# Altium schematic sheet SAMC21_one.SchDoc: Sheet Description
size A3; Organization: Organization; Address1: Address1; Address2: Address2; Address3: Address3; Address4: Address4; DocumentNumber: 1; Revision: 0; SheetNumber: 2; SheetTotal: 2; PageSetup: Record=PageOptions|CenterHorizontal=True|CenterVertical=True|PrintScale=1.00|XCorrection=1.00|YCorrection=1.00|PrintKind=1|BorderSize=5000000|LeftOffset=0|BottomOffset=0|Orientation=2|PaperLength=1000|PaperWidth=1000|Scale=100|PaperSource=7|PrintQuality=-4|MediaType=1|DitherType=10|PaperKind=A3|PrintScaleMode=0
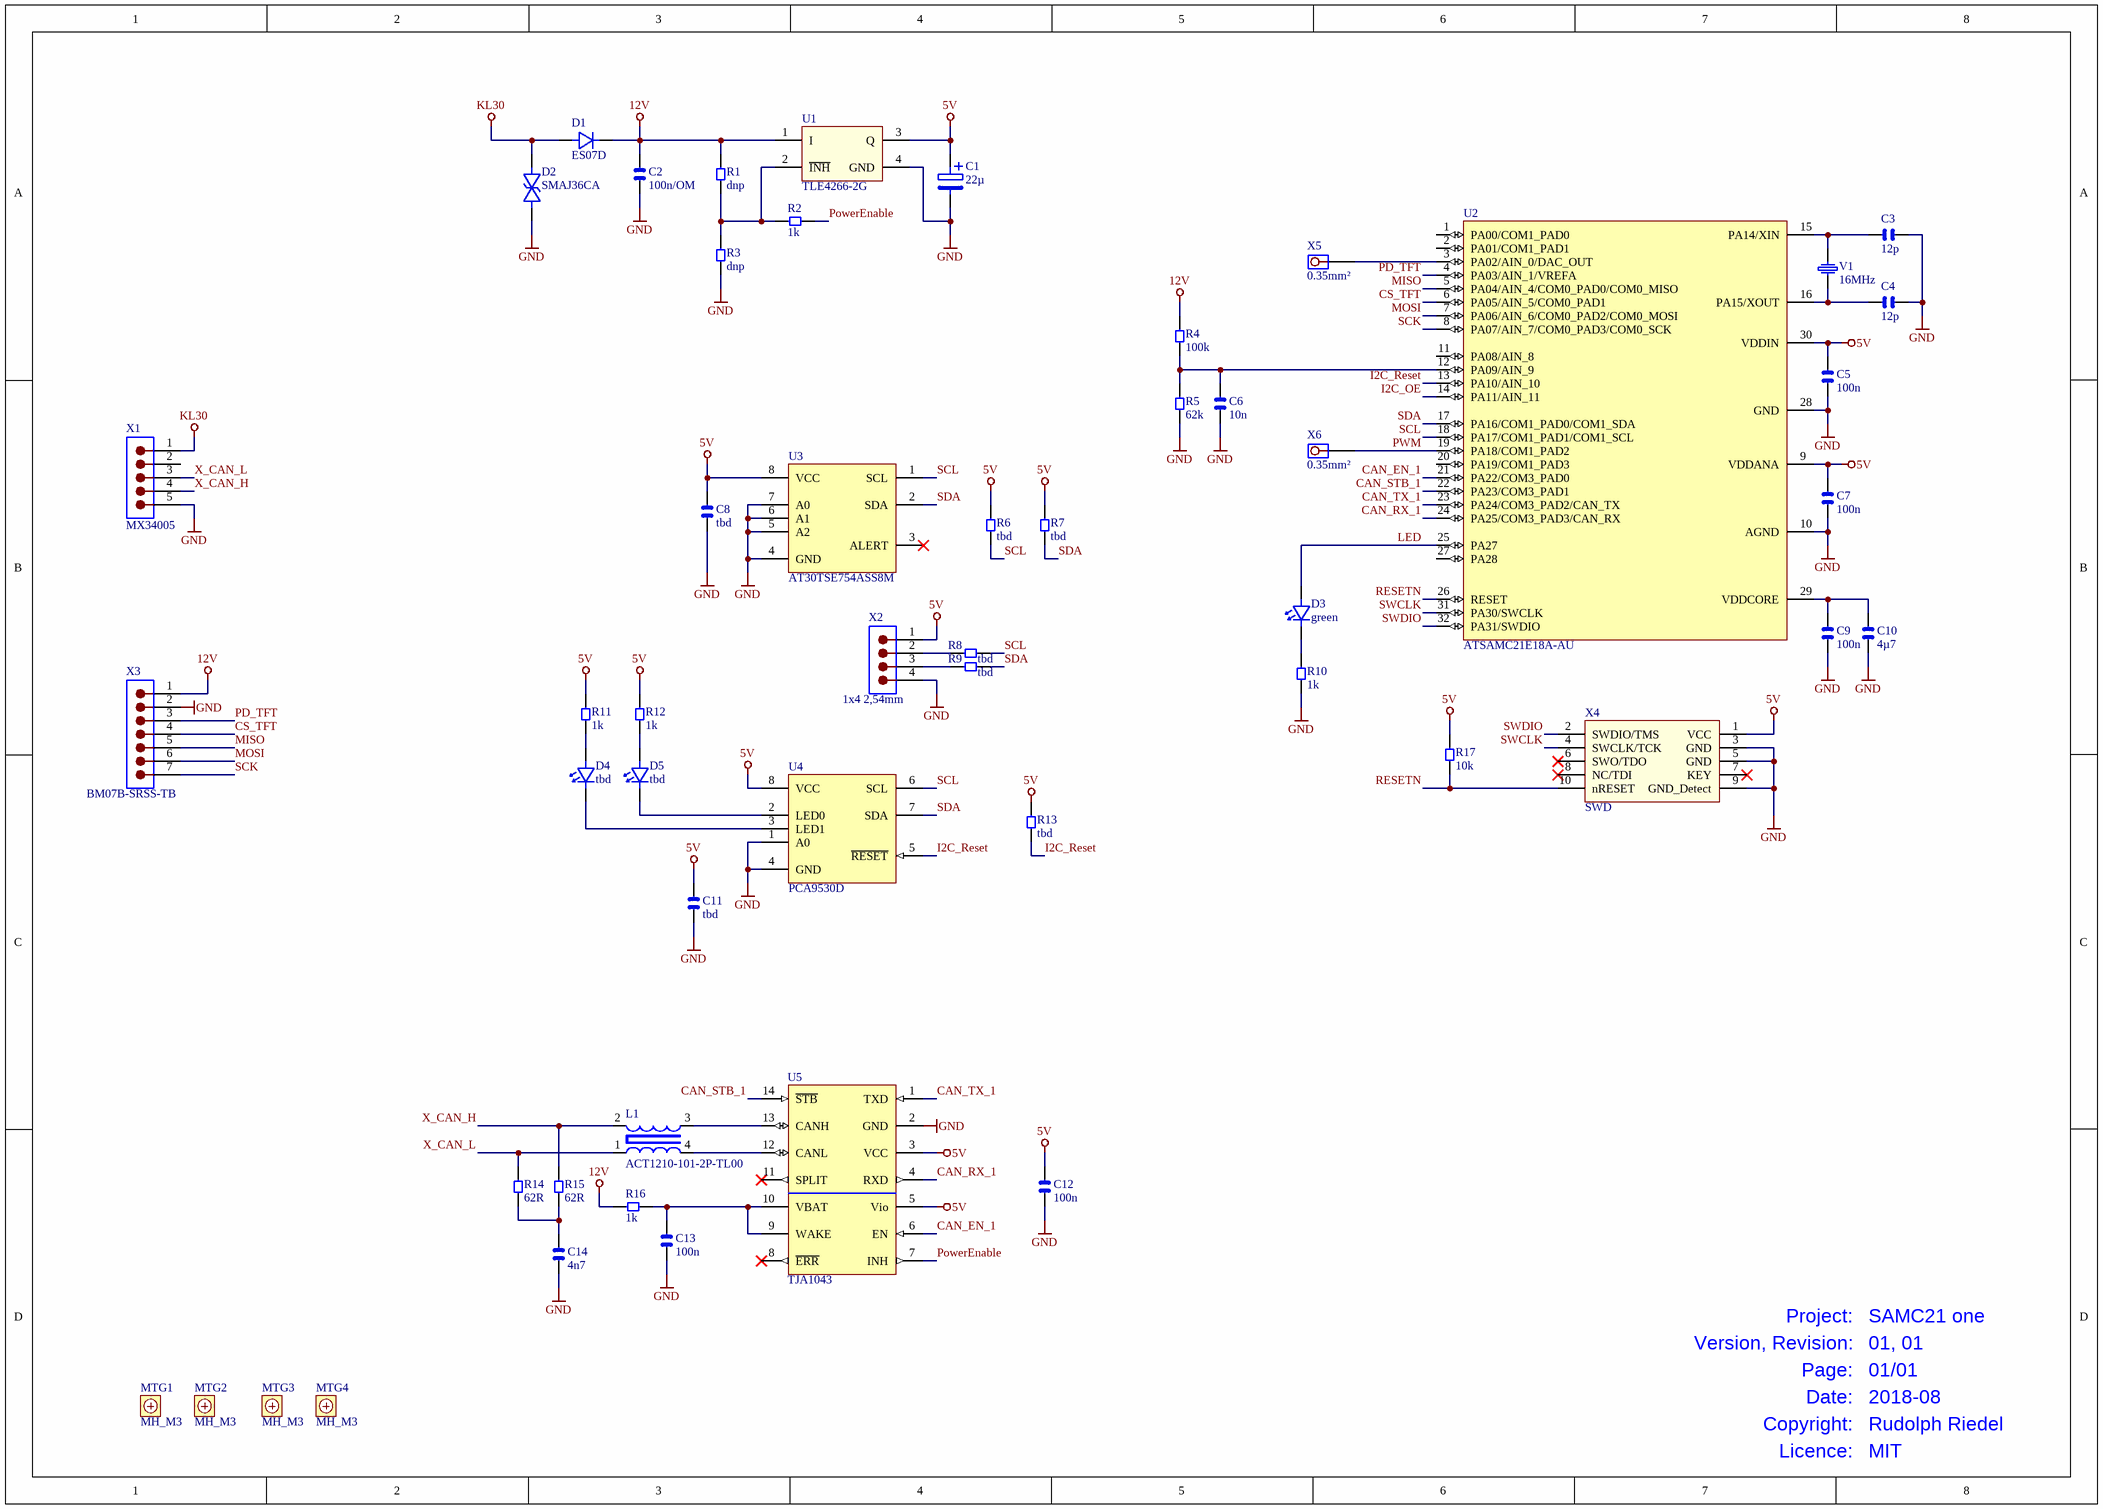
[diagram p0: SAMC21_one.SchDoc]

## Parts
C1  22µ  [CAPMP3528X21N]
C2  100n/OM  [CAPC2012X14L]
C3  12p  [CAPC2012X14L]
C4  12p  [CAPC2012X14L]
C5  100n  [CAPC1608X09L]
C6  10n  [CAPC2012X14L]
C7  100n  [CAPC1608X09L]
C8  tbd  [CAPC2012X14L]
C9  100n  [CAPC1608X09L]
C10  4µ7  [CAPC2012X14L]
C11  tbd  [CAPC2012X14L]
C12  100n  [CAPC2012X14L]
C13  100n  [CAPC2012X14L]
C14  4n7  [CAPC2012X14L]
D1  ES07D  [DIOM2818X11N]
D2  SMAJ36CA  [DIOM5226X23N]
D3  green  [DIOC2012X10N]
D4  tbd  [DIOC2012X10N]
D5  tbd  [DIOC2012X10N]
L1  ACT1210-101-2P-TL00  [ACT1210]
MTG1  MH_M3  [HOLE_3_2MM]  (no BOM)
MTG2  MH_M3  [HOLE_3_2MM]  (no BOM)
MTG3  MH_M3  [HOLE_3_2MM]  (no BOM)
MTG4  MH_M3  [HOLE_3_2MM]  (no BOM)
R1  dnp  [RESC2012X06L]
R2  1k  [RESC2012X06L]
R3  dnp  [RESC2012X06L]
R4  100k  [RESC2012X06L]
R5  62k  [RESC2012X06L]
R6  tbd  [RESC2012X06L]
R7  tbd  [RESC2012X06L]
R8  tbd  [RESC2012X06L]
R9  tbd  [RESC2012X06L]
R10  1k  [RESC2012X06L]
R11  1k  [RESC2012X06L]
R12  1k  [RESC2012X06L]
R13  tbd  [RESC2012X06L]
R14  62R  [RESC3216X07N]
R15  62R  [RESC3216X07N]
R16  1k  [RESC2012X06L]
R17  10k  [RESC2012X06L]
U1  TLE4266-2G  [SOT230P700X180-4N]
U2  ATSAMC21E18A-AU  [TQFP80P900X900X120-32N]
U3  AT30TSE754ASS8M  [SOIC127P600X175-8N]
U4  PCA9530D  [TSOP65P640X120-8N]
U5  TJA1043  [SOIC127P600X175-14N]
V1  16MHz  [NX3225Gx]
X1  MX34005  [MX34005]
X2  1x4 2,54mm  [PINH_1x04_2_54mm]
X3  BM07B-SRSS-TB  [BM07B-SRSS-TB]
X4  SWD  [FTSH-105-01-L-DV-K]
X5  0.35mm²  [PAD035X160]
X6  0.35mm²  [PAD035X160]

## Nets
5V: C1.1 C5.2 C7.2 C8.2 C11.2 C12.2 R6.2 R7.2 R11.2 R12.2 R13.2 R17.2 U1.3(Q) U2.9(VDDANA) U2.30(VDDIN) U3.8(VCC) U4.8(VCC) U5.3(VCC) U5.5(Vio) X2.1 X4.1(VCC)
12V: C2.2 D1.1 R1.2 R4.2 R16.1 U1.1(I) X3.1
GND: C1.2 C2.1 C3.2 C4.2 C5.1 C6.1 C7.1 C8.1 C9.1 C10.1 C11.1 C12.1 C13.1 C14.1 D2.1 R3.1 R5.1 R10.1 U1.4(GND) U2.10(AGND) U2.28(GND) U3.4(GND) U3.5(A2) U3.6(A1) U3.7(A0) U4.1(A0) U4.4(GND) U5.2(GND) X1.5 X2.4 X3.2 X4.3(GND) X4.5(GND) X4.9(GND_Detect)
KL30: D1.2 D2.2 X1.1
CAN_EN_1: U2.21(PA22/COM3_PAD0) U5.6(EN)
CAN_RX_1: U2.24(PA25/COM3_PAD3/CAN_RX) U5.4(RXD)
CAN_STB_1: U2.22(PA23/COM3_PAD1) U5.14(~{STB})
CAN_TX_1: U2.23(PA24/COM3_PAD2/CAN_TX) U5.1(TXD)
CS_TFT: U2.6(PA05/AIN_5/COM0_PAD1) X3.4
I2C_OE: U2.14(PA11/AIN_11)
I2C_Reset: R13.1 U2.13(PA10/AIN_10) U4.5(~{RESET})
LED: D3.2 U2.25(PA27)
MISO: U2.5(PA04/AIN_4/COM0_PAD0/COM0_MISO) X3.5
MOSI: U2.7(PA06/AIN_6/COM0_PAD2/COM0_MOSI) X3.6
PD_TFT: U2.4(PA03/AIN_1/VREFA) X3.3
PowerEnable: R2.1 U5.7(INH)
PWM: U2.19(PA18/COM1_PAD2) X6.1
RESETN: R17.1 U2.26(RESET) X4.10(nRESET)
SCK: U2.8(PA07/AIN_7/COM0_PAD3/COM0_SCK) X3.7
SCL: R6.1 R8.2 U2.18(PA17/COM1_PAD1/COM1_SCL) U3.1(SCL) U4.6(SCL)
SDA: R7.1 R9.2 U2.17(PA16/COM1_PAD0/COM1_SDA) U3.2(SDA) U4.7(SDA)
SWCLK: U2.31(PA30/SWCLK) X4.4(SWCLK/TCK)
SWDIO: U2.32(PA31/SWDIO) X4.2(SWDIO/TMS)
X_CAN_H: L1.2 R15.2 X1.4
X_CAN_L: L1.1 R14.2 X1.3
NetC3_1: C3.1 U2.15(PA14/XIN) V1.2
NetC4_1: C4.1 U2.16(PA15/XOUT) V1.1
NetC6_2: C6.2 R4.1 R5.2 U2.12(PA09/AIN_9)
NetC9_2: C9.2 C10.2 U2.29(VDDCORE)
NetC13_2: C13.2 R16.2 U5.9(WAKE) U5.10(VBAT)
NetC14_2: C14.2 R14.1 R15.1
NetD3_1: D3.1 R10.2
NetD4_1: D4.1 U4.3(LED1)
NetD4_2: D4.2 R11.1
NetD5_1: D5.1 U4.2(LED0)
NetD5_2: D5.2 R12.1
NetL1_3: L1.3 U5.13(CANH)
NetL1_4: L1.4 U5.12(CANL)
NetR1_1: R1.1 R2.2 R3.2 U1.2(~{INH})
NetR8_1: R8.1 X2.2
NetR9_1: R9.1 X2.3
NetU2_3: U2.3(PA02/AIN_0/DAC_OUT) X5.1

Not connected (* = marked no-connect by the designer): U2 1(PA00/COM1_PAD0) 2(PA01/COM1_PAD1) 11(PA08/AIN_8) 20(PA19/COM1_PAD3) 27(PA28); U3 3(ALERT)*; U5 8(~{ERR})* 11(SPLIT)*; X1 2; X4 6(SWO/TDO)* 7(KEY)* 8(NC/TDI)*

## Notes on the sheet
- Project:
- SAMC21 one
- Version, Revision:
- Page:
- 01, 01
- 01/01
- Date:
- Copyright:
- Licence:
- 2018-08
- Rudolph Riedel
- MIT

## Library data of the parts
C1 = CAPMP_B: Tantalkondensator SMD Bauform B; Ersteller: rriedel; Freigabe: tested; Kategorie: generisch; Unterart: gepolt; Part Number: CAPMP_B; Value: 22µ; Bauteilart: Kondensator; PackageDescription: Tantal B
C2-C4 C6 C8 C10-C14 = CAPC_0805: 0805 Chip Capacitor; Ersteller: rriedel; Freigabe: tested; Bauteilart: Kondensator; Kategorie: generisch; Unterart: ungepolt; Part Number: CAPC_0805; PackageDescription: 0805
  C2: Value: 100n/OM
  C3 C4: Value: 12p
  C6: Value: 10n
  C8 C11: Value: tbd
  C10: Value: 4µ7
  C12 C13: Value: 100n
  C14: Value: 4n7
C5 C7 C9 = CAPC_0603: 0603 Chip Capacitor; Ersteller: rriedel; Freigabe: tested; Bauteilart: Kondensator; Kategorie: generisch; Unterart: ungepolt; Part Number: CAPC_0603; Value: 100n; PackageDescription: 0603
D1 = ES07D: Ultrafast Rectifier Surface Mount,  IF 0.5A, VR 100V, DO-219AB, AEC-Q101; Ersteller: rriedel; Freigabe: tested; Bauteilart: Diode; Kategorie: Bauteil; Hersteller: Vishay; Part Number: ES07D; Value: ES07D; Erstelldatum: 09.10.2013; Unterart: Rectifier; PackageDescription: DO-219AB; Hersteller_Code_1: ES07D
D2 = SMAJ36CA: Transildiode Bidirectional 400W 36V; Ersteller: rriedel; Freigabe: tested; Bauteilart: Diode; Kategorie: Bauteil; Hersteller: DIODES; Hersteller_Code_1: SMAJ36CA-13-F; Part Number: SMAJ36CA; Value: SMAJ36CA; Erstelldatum: 15.09.2016; Unterart: Transil; PackageDescription: SMA
D3-D5 = LED_0805: LED, 0805; Ersteller: rriedel; Freigabe: tested; Bauteilart: Diode; Kategorie: generisch; Part Number: LED_0805; Erstelldatum: 25.07.2017; PackageDescription: 0805
  D3: Value: green
  D4 D5: Value: tbd
L1 = ACT1210-101-2P-TL00: Common Mode Filter,  -50°C ... +150°C, AEC-Q200; Ersteller: rriedel; Freigabe: tested; Bauteilart: Spule; Kategorie: Bauteil; Hersteller: TDK; Part Number: ACT1210-101-2P-TL00; Value: ACT1210-101-2P-TL00; Erstelldatum: 17.10.2017; Unterart: Filter; PackageDescription: 3225; Hersteller_Code_1: ACT1210-101-2P-TL00; Distributor_1: Farnell; Distributor_1_Part_Number: 2442838; Distributor_2: Digi-Key; Distributor_2_Part_Number: 445-172386-1-ND
MTG1-MTG4 = MH_M3: Mounting-Hole for M3 screws; Ersteller: rriedel; Freigabe: tested; Bauteilart: Mechanic; Kategorie: No_Bom; Unterart: Holes; Part Number: MH_M3; Value: MH_M3; Erstelldatum: 13.05.2018
R1-R13 R16 R17 = RESC_0805: 0805 Chip Resistor; Ersteller: rriedel; Freigabe: tested; Bauteilart: Widerstand; Kategorie: generisch; Unterart: Standard; Part Number: RESC_0805; PackageDescription: 0805
  R1 R3: Value: dnp
  R2 R10-R12 R16: Value: 1k
  R4: Value: 100k
  R5: Value: 62k
  R6-R9 R13: Value: tbd
  R17: Value: 10k
R14 R15 = RESC_1206: 1206 Chip Resistor; Ersteller: rriedel; Freigabe: tested; Bauteilart: Widerstand; Kategorie: generisch; Unterart: Standard; Part Number: RESC_1206; Value: 62R; PackageDescription: 1206
U1 = TLE4266-2G: 150 mA LDO, Vout = 5,0V, 2%, Enable; Ersteller: rriedel; Freigabe: tested; Bauteilart: IC; Kategorie: Bauteil; Unterart: Linear-Regulators; Hersteller: Infineon; Part Number: TLE4266-2G; Value: TLE4266-2G; Erstelldatum: 31.03.2019; PackageDescription: SOT223; Hersteller_Code_1: TLE4266-2G; Distributor_1: Digi-Key; Distributor_2: Farnell
U2 = ATSAMC21E18A-AU: 32-bit Microcontroller, 48MHz Cortex M0, 256k FLASH,  1x CAN-FD, -40…85°C; Ersteller: rriedel; Freigabe: tested; Bauteilart: MikroController; Kategorie: Bauteil; Unterart: 32bit Microchip; Hersteller: Microchip; Part Number: ATSAMC21E18A-AU; Value: ATSAMC21E18A-AU; Erstelldatum: 11.08.2018; PackageDescription: TQFP32; Hersteller_Code_1: ATSAMC21E18A-AU
U3 = AT30TSE754ASS8M: I2C Digital Temperature Sensor and EEPROM; Ersteller: rriedel; Freigabe: tested; Bauteilart: IC; Kategorie: Bauteil; Unterart: Memory; Hersteller: Microchip; Part Number: AT30TSE754ASS8M; Value: AT30TSE754ASS8M; Erstelldatum: 11.08.2018; PackageDescription: SO8; Hersteller_Code_1: AT30TSE754ASS8M
U4 = PCA9530D: 2-bit I2C LED dimmer; Ersteller: rriedel; Freigabe: tested; Bauteilart: IC; Kategorie: Bauteil; Unterart: LED-Driver; Hersteller: NXP; Part Number: PCA9530D; Value: PCA9530D; Erstelldatum: 11.08.2018; PackageDescription: TSSOP-8; Hersteller_Code_1: PCA9530D
U5 = TJA1043T: HS Can Transceiver with wake-up Tvj= -40 to 150 °C; Ersteller: rriedel; Freigabe: tested; Bauteilart: IC; Kategorie: Bauteil; Unterart: Interface; Hersteller: NXP; Part Number: TJA1043T; Value: TJA1043; Erstelldatum: 10.10.2012; PackageDescription: SO14; Hersteller_Code_1: TJA1043T
V1 = NX3225GB-16.000000MHZ: 16.000MHz Crystal SMD, 3.2x2.5mm, 8pF, 50ppm,  -40..+150°C; Ersteller: rriedel; Freigabe: tested; Bauteilart: Quarz; Kategorie: Bauteil; Unterart: NX3225GB automotive; Hersteller: NDK; Hersteller_Code_1: NX3225GB-16M-STD-CRA-2; Part Number: NX3225GB-16.000000MHZ; Value: 16MHz; Erstelldatum: 22.10.2015; PackageDescription: NX3225Gx 3,2mm x 2,5mm; Distributor_1: Digi-Key; Distributor_1_Part_Number: 644-1233-1-ND; Distributor_2: Frischer
X1 = MX34005: PCB Header, Automotive, single row, 5 pins; Ersteller: rriedel; Freigabe: tested; Bauteilart: Steckverbinder; Kategorie: Bauteil; Unterart: MX34; Hersteller: JAE; Part Number: MX34005; Value: MX34005; Erstelldatum: 03.06.2018; PackageDescription: MX34005
X2 = PINH_1x4_2_54: Pin-Header 2,54 mm 4pins; Ersteller: rriedel; Freigabe: tested; Bauteilart: Steckverbinder; Kategorie: generisch; Unterart: Stiftleisten; Part Number: PINH_1x4_2_54; Value: 1x4 2,54mm; Erstelldatum: 02.02.2017
X3 = SM07B-SRSS-TB: JST PCB Header SH, 7pins, 1,0mm, -25°C to +85°C; Ersteller: rriedel; Freigabe: tested; Bauteilart: Steckverbinder; Kategorie: Bauteil; Unterart: JST SH; Part Number: SM07B-SRSS-TB; Value: BM07B-SRSS-TB; Erstelldatum: 20.04.2018; PackageDescription: SH-7; Hersteller: JST; Hersteller_Code_1: BM07B-SRSS-TB; Distributor_1: RS; Distributor_1_Part_Number: 546-8798; Distributor_2: Digi-Key; Distributor_2_Part_Number: 455-1793-1-ND
X4 = SWD: ARM Debug-Header 2x5 1,27 mm; Ersteller: rriedel; Freigabe: tested; Bauteilart: Steckverbinder; Kategorie: Bauteil; Unterart: Debug; Part Number: SWD; Value: SWD; Erstelldatum: 12.08.2018; PackageDescription: 2x5 1,27mm
X5 X6 = PAD035: Wire pad 0,35mm²; Part Number: PAD035; Ersteller: rriedel; Freigabe: tested; Kategorie: generisch; Value: 0.35mm²; Erstelldatum: 15.01.2014; Bauteilart: PAD